# EasyEDA schematic Task 10.1 S_2020-06-05_09-16-43.json
TITLE: Sheet_1; REV: 1.0; Date: 2020-06-05; Sheet: 1/1; Company: Your Company
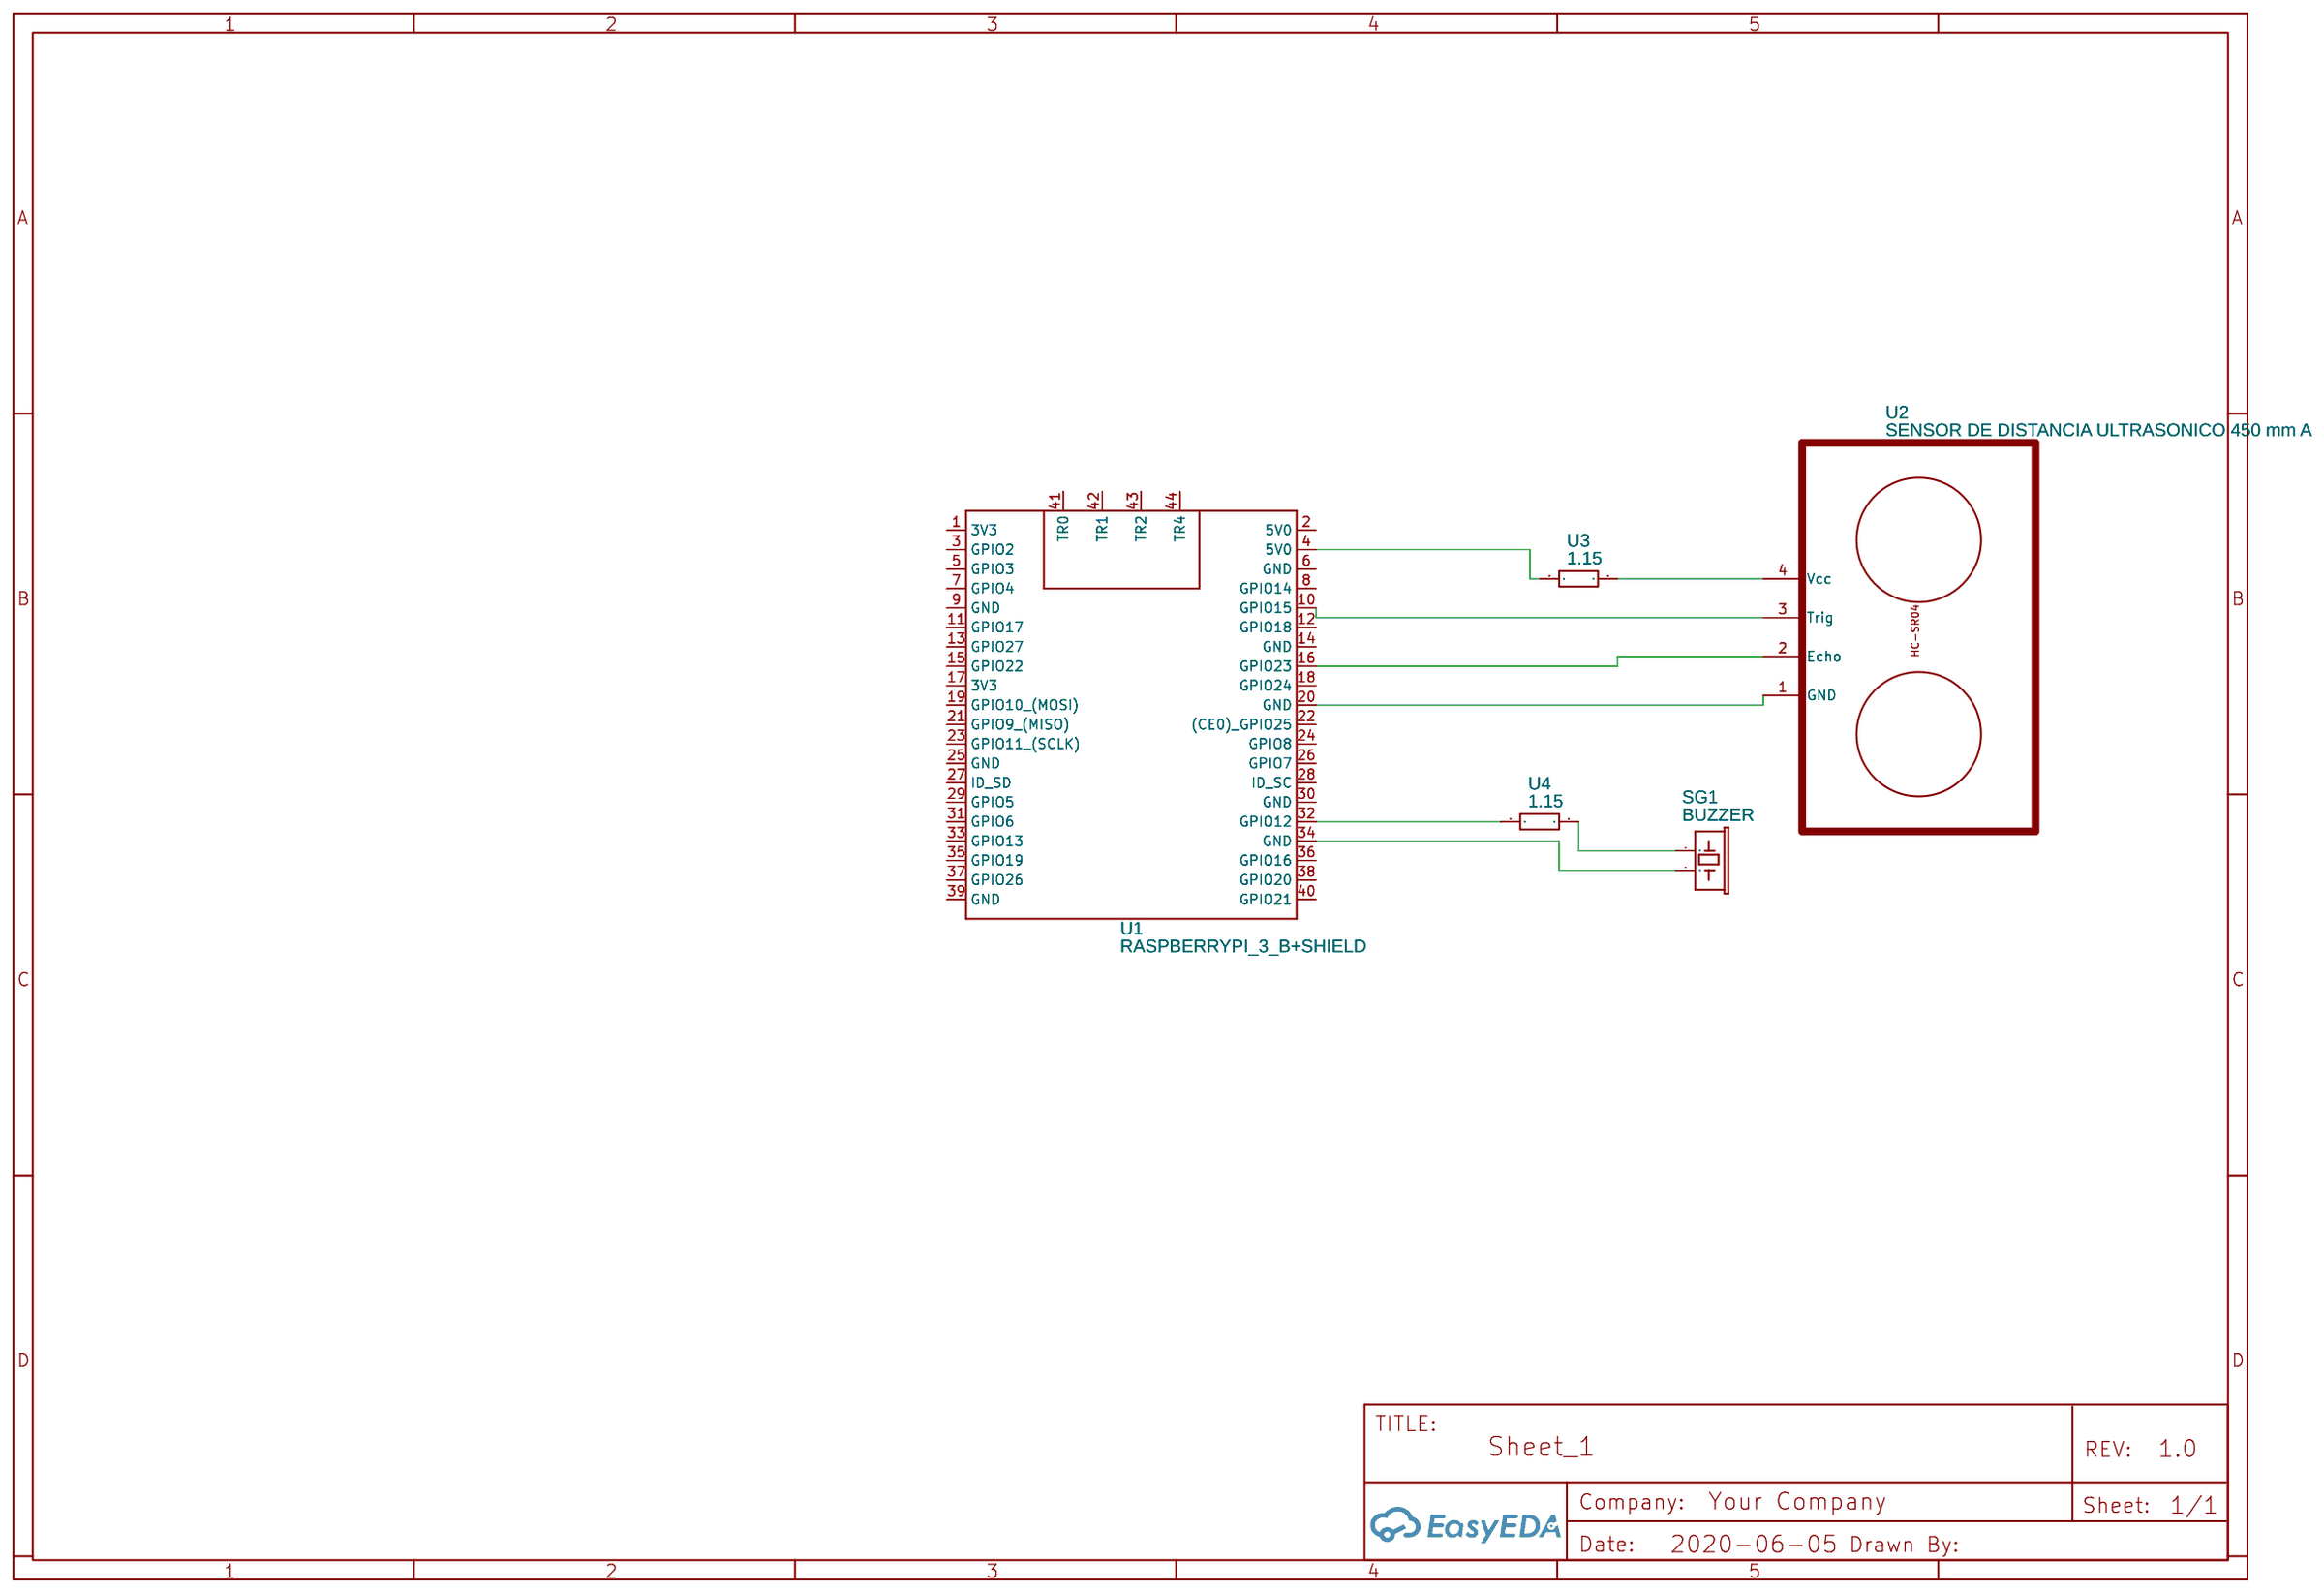
[diagram p0: schematic sheet]

## Parts
SG1  BUZZER  [BUZZER-12MM-NS]
U1  RASPBERRYPI_3_B+SHIELD  [RASBERRYPI_3_B+_POE]
U2  SENSOR DE DISTANCIA ULTRASONICO 450 mm A  [CLASE6_SENSOR_ULTRASONIDO]
U3  1.15  [RES-SMD_L3.5-W1.5]
U4  1.15  [RES-SMD_L3.5-W1.5]

## Library data of the parts
SG1 = BUZZER: Contributor: SparkFun
U1 = RASPBERRYPI_3_B+SHIELD: Manufacturer Part: RaspberryPi 3; Contributor: May011986
U2 = SENSOR DE DISTANCIA ULTRASONICO 450 mm A: Contributor: EDK LOAA
U3 U4 = MELF-MFR02041/4WS1.15ΩFT50: Supplier: LCSC; Supplier Part: C266017; Manufacturer: Thunder Component; Contributor: LCSC

## Nets
Net-(SG1-+): SG1.+(1) U4.2
Net-(SG1--): SG1.-(2) U1.34(GND)
Net-(U1-4): U1.4(5V0) U3.1
Net-(U1-10): U1.10(GPIO15) U2.3(Trig)
Net-(U1-16): U1.16(GPIO23) U2.2(Echo)
Net-(U1-20): U1.20(GND) U2.1(GND)
Net-(U1-32): U1.32(GPIO12) U4.1
Net-(U2-4): U2.4(Vcc) U3.2

Not connected (* = marked no-connect by the designer): U1 1(3V3) 2(5V0) 3(GPIO2) 5(GPIO3) 6(GND) 7(GPIO4) 8(GPIO14) 9(GND) 11(GPIO17) 12(GPIO18) 13(GPIO27) 14(GND) 15(GPIO22) 17(3V3) 18(GPIO24) 19(GPIO10 (MOSI)) 21(GPIO9 (MISO)) 22((CE0) GPIO25) 23(GPIO11 (SCLK)) 24(GPIO8) 25(GND) 26(GPIO7) 27(ID_SD) 28(ID_SC) 29(GPIO5) 30(GND) 31(GPIO6) 33(GPIO13) 35(GPIO19) 36(GPIO16) 37(GPIO26) 38(GPIO20) 39(GND) 40(GPIO21) 41(TR0) 42(TR1) 43(TR2) 44(TR4)
